# Altium project Dung_esp_PCB_Project.prjpcb
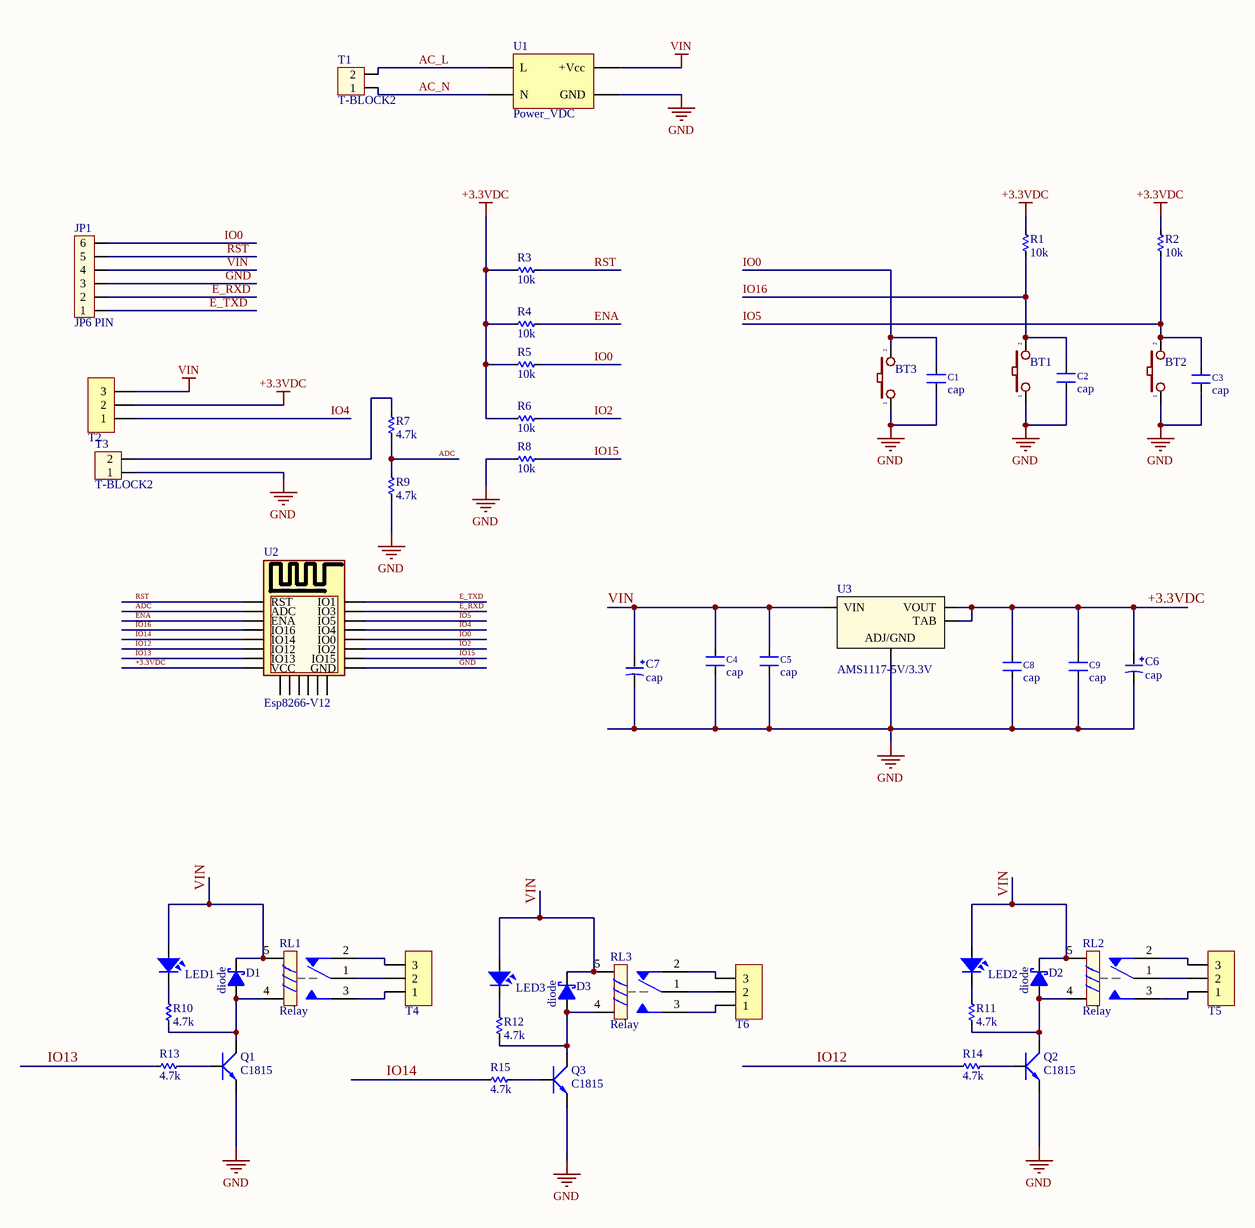
[diagram p0: Sheet1.SchDoc]
1 sheet, 49 parts. Net scope: global (net labels, ports and power ports of the same name join across sheets).
Board file: PCB2.PcbDoc

## Sheet Sheet1.SchDoc
size A3

### Parts
BT1  BUTTON1  [SW4]  (value not drawn)
BT2  BUTTON1  [SW4]  (value not drawn)
BT3  BUTTON1  [SW4]  (value not drawn)
C1  cap  [SM-CAP-0805]
C2  cap  [SM-CAP-0805]
C3  cap  [SM-CAP-0805]
C4  cap  [SM-CAP-0805]
C5  cap  [SM-CAP-0805]
C6  cap  [CA-ALU-8]
C7  cap  [CA-ALU-8]
C8  cap  [SM-CAP-0805]
C9  cap  [SM-CAP-0805]
D1  diode  [DO-214AC(SMA)]
D2  diode  [DO-214AC(SMA)]
D3  diode  [DO-214AC(SMA)]
JP1  JP6 PIN  [JP6]
LED1  LED  [LED-5-BLUE]  (value not drawn)
LED2  LED  [LED-5-BLUE]  (value not drawn)
LED3  LED  [LED-5-BLUE]  (value not drawn)
Q1  C1815  [SOT23B]
Q2  C1815  [SOT23B]
Q3  C1815  [SOT23B]
R1  10k  [RES-SMD-0805]
R2  10k  [RES-SMD-0805]
R3  10k  [RES-SMD-0805]
R4  10k  [RES-SMD-0805]
R5  10k  [RES-SMD-0805]
R6  10k  [RES-SMD-0805]
R7  4.7k  [RES-SMD-0805]
R8  10k  [RES-SMD-0805]
R9  4.7k  [RES-SMD-0805]
R10  4.7k  [RES-SMD-0805]
R11  4.7k  [RES-SMD-0805]
R12  4.7k  [RES-SMD-0805]
R13  4.7k  [RES-SMD-0805]
R14  4.7k  [RES-SMD-0805]
R15  4.7k  [RES-SMD-0805]
RL1  Relay  [RL-05VDC-10A]
RL2  Relay  [RL-05VDC-10A]
RL3  Relay  [RL-05VDC-10A]
T1  T-BLOCK2  [T-BOCK2-p]
T2  T-Block3  [T-Block3]  (value not drawn)
T3  T-BLOCK2  [T-BOCK2-p]
T4  T-Block3  [T-Block3]  (value not drawn)
T5  T-Block3  [T-Block3]  (value not drawn)
T6  T-Block3  [T-Block3]  (value not drawn)
U1  Power_VDC  [AC_DC_Convert]
U2  Esp8266-V12  [ESP8266-12F]
U3  AMS1117-5V/3.3V  [SOT-223]

### Nets
+3.3VDC: C6.1 C8.2 C9.2 R1.2 R2.2 R3.1 R4.1 R5.1 R6.1 T2.2 U2.8(VCC) U3.2(VOUT) U3.4(TAB)
GND: BT1.1 BT2.1 BT3.1 C1.1 C2.1 C3.1 C4.1 C5.1 C6.2 C7.2 C8.1 C9.1 JP1.3 Q1.1(E) Q2.1(E) Q3.1(E) R8.1 R9.2 T3.1 U1.3(GND) U2.15(GND) U3.1(ADJ/GND)
VIN: C4.2 C5.2 C7.1 D1.K D2.K D3.K JP1.4 LED1.1 LED2.1 LED3.1 RL1.5 RL2.5 RL3.5 T2.3 U1.4(+Vcc) U3.3(VIN)
AC_L: T1.2 U1.1(L)
AC_N: T1.1 U1.2(N)
ADC: R7.2 R9.1 U2.2(ADC)
E_RXD: JP1.2 U2.21(IO3)
E_TXD: JP1.1 U2.22(IO1)
ENA: R4.2 U2.3(ENA)
IO0: BT3.2 C1.2 JP1.6 R5.2 U2.18(IO0)
IO2: R6.2 U2.17(IO2)
IO4: T2.1 U2.19(IO4)
IO5: BT2.2 C3.2 R2.1 U2.20(IO5)
IO12: R14.1 U2.6(IO12)
IO13: R13.1 U2.7(IO13)
IO14: R15.1 U2.5(IO14)
IO15: R8.2 U2.16(IO15)
IO16: BT1.2 C2.2 R1.1 U2.4(IO16)
RST: JP1.5 R3.2 U2.1(RST)
NetD1_A: D1.A Q1.2(C) R10.1 RL1.4
NetD2_A: D2.A Q2.2(C) R11.1 RL2.4
NetD3_A: D3.A Q3.2(C) R12.1 RL3.4
NetLED1_2: LED1.2 R10.2
NetLED2_2: LED2.2 R11.2
NetLED3_2: LED3.2 R12.2
NetQ1_3: Q1.3(B) R13.2
NetQ2_3: Q2.3(B) R14.2
NetQ3_3: Q3.3(B) R15.2
NetR7_1: R7.1 T3.2
NetRL1_1: RL1.1 T4.2
NetRL1_2: RL1.2 T4.3
NetRL1_3: RL1.3 T4.1
NetRL2_1: RL2.1 T5.2
NetRL2_2: RL2.2 T5.3
NetRL2_3: RL2.3 T5.1
NetRL3_1: RL3.1 T6.2
NetRL3_2: RL3.2 T6.3
NetRL3_3: RL3.3 T6.1

Not connected (* = marked no-connect by the designer): U2 9 10 11 12 13 14

### Library data of the parts
BT1-BT3 = BUTTON1: Value: 1N4007
C1-C5 C8 C9 = CAP SMD: Value: 0,1uF/300V; Designed by: VanDungEvn
C6 C7 = CAP-ALU-DIP: Capacitor (Semiconductor SIM Model); Value: 104; LatestRevisionDate: 17-Jul-2002; LatestRevisionNote: Re-released for DXP Platform.; PackageReference: C1206; Publisher: Altium Limited
D1-D3 = Diode  Schottky _1: Diode  Schottky; pin to pad: A>1 K>2; Value: 1N4007
JP1 = JP6: Value: JP7
LED1-LED3 = LED: LED Single colour Green and Red; Value: LED 3 ly Single Colour
Q1-Q3 = C1815: NPN 600mW, ECB; pin to pad: 1>2 2>3 3>1; Value: C1815
R1-R15 = Res-SMD: Resistor; Manufacturer: Generic Components; Class: Passive; Published: 08/06/2000; Publisher: Altium Hobart Technology Centre
RL1-RL3 = Relay 5VDC: Relay SPDT 5 Pin; Value: Relay SPDT, 10A, 12V
T1 T3 = T-BLOCK2: T-BLOCK2(Green); Value: Header 2
U1 = AC_DC_convert
U2 = Esp8266-V12: NodeMcu
U3 = AMS1117: IC on ap 5V/3.3V; ComponentLink1Description: Datasheet; ComponentLink1URL: http://www.ti.com/lit/ds/symlink/lm1117.pdf